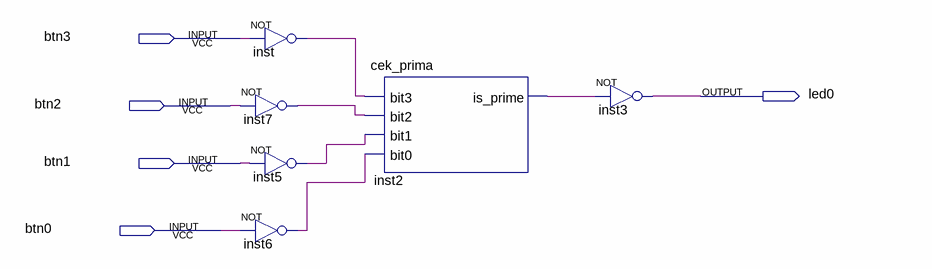
[diagram p0: schematic sheet]
// Quartus schematic tes_cek_prima.bdf as structural Verilog: 6 symbols, 5 pins
module tes_cek_prima (
  input  btn3,
  input  btn2,
  input  btn1,
  input  btn0,
  output led0
);

  wire inst2_is_prime, inst5_out, inst6_out, inst7_out, inst_out;

  not inst (inst_out, btn3);
  not inst7 (inst7_out, btn2);
  not inst5 (inst5_out, btn1);
  not inst6 (inst6_out, btn0);
  cek_prima inst2 (.bit3(inst_out), .bit2(inst7_out), .bit1(inst5_out), .bit0(inst6_out), .is_prime(inst2_is_prime));
  not inst3 (led0, inst2_is_prime);
endmodule
